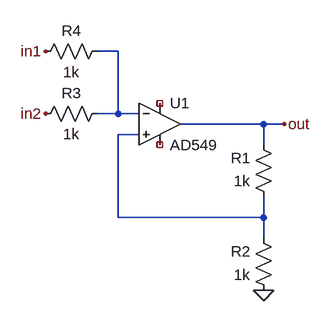
[diagram p0: schematic NonInvertingAdder.asc]
NonInvertingAdder.asc, the LTspice schematic file:
Version 4
SHEET 1 880 680
WIRE 272 64 240 64
WIRE 272 160 272 64
WIRE 272 160 240 160
WIRE 304 160 272 160
WIRE 496 176 368 176
WIRE 528 176 496 176
WIRE 304 192 272 192
WIRE 496 208 496 176
WIRE 272 320 272 192
WIRE 496 320 496 288
WIRE 496 320 272 320
WIRE 496 352 496 320
FLAG 496 432 0
FLAG 160 64 in1
FLAG 160 160 in2
FLAG 528 176 out
SYMBOL Opamps\\AD549 336 112 R0
SYMATTR InstName U1
SYMBOL res 512 304 R180
WINDOW 0 36 76 Left 2
WINDOW 3 36 40 Left 2
SYMATTR InstName R1
SYMATTR Value 1k
SYMBOL res 512 448 R180
WINDOW 0 36 76 Left 2
WINDOW 3 36 40 Left 2
SYMATTR InstName R2
SYMATTR Value 1k
SYMBOL res 256 144 R90
WINDOW 0 0 56 VBottom 2
WINDOW 3 32 56 VTop 2
SYMATTR InstName R3
SYMATTR Value 1k
SYMBOL res 256 48 R90
WINDOW 0 0 56 VBottom 2
WINDOW 3 32 56 VTop 2
SYMATTR InstName R4
SYMATTR Value 1k

The netlist it stands for:
* NonInvertingAdder.asc
XU1 N002 N001 NC_01 NC_02 out AD549  ; pins In+ In- V+ V- OUT
R1 N002 out 1k
R2 0 N002 1k
R3 N001 in2 1k
R4 N001 in1 1k
.backanno
.end